# EAGLE design battery_monitor (EAGLE 6.6.0)
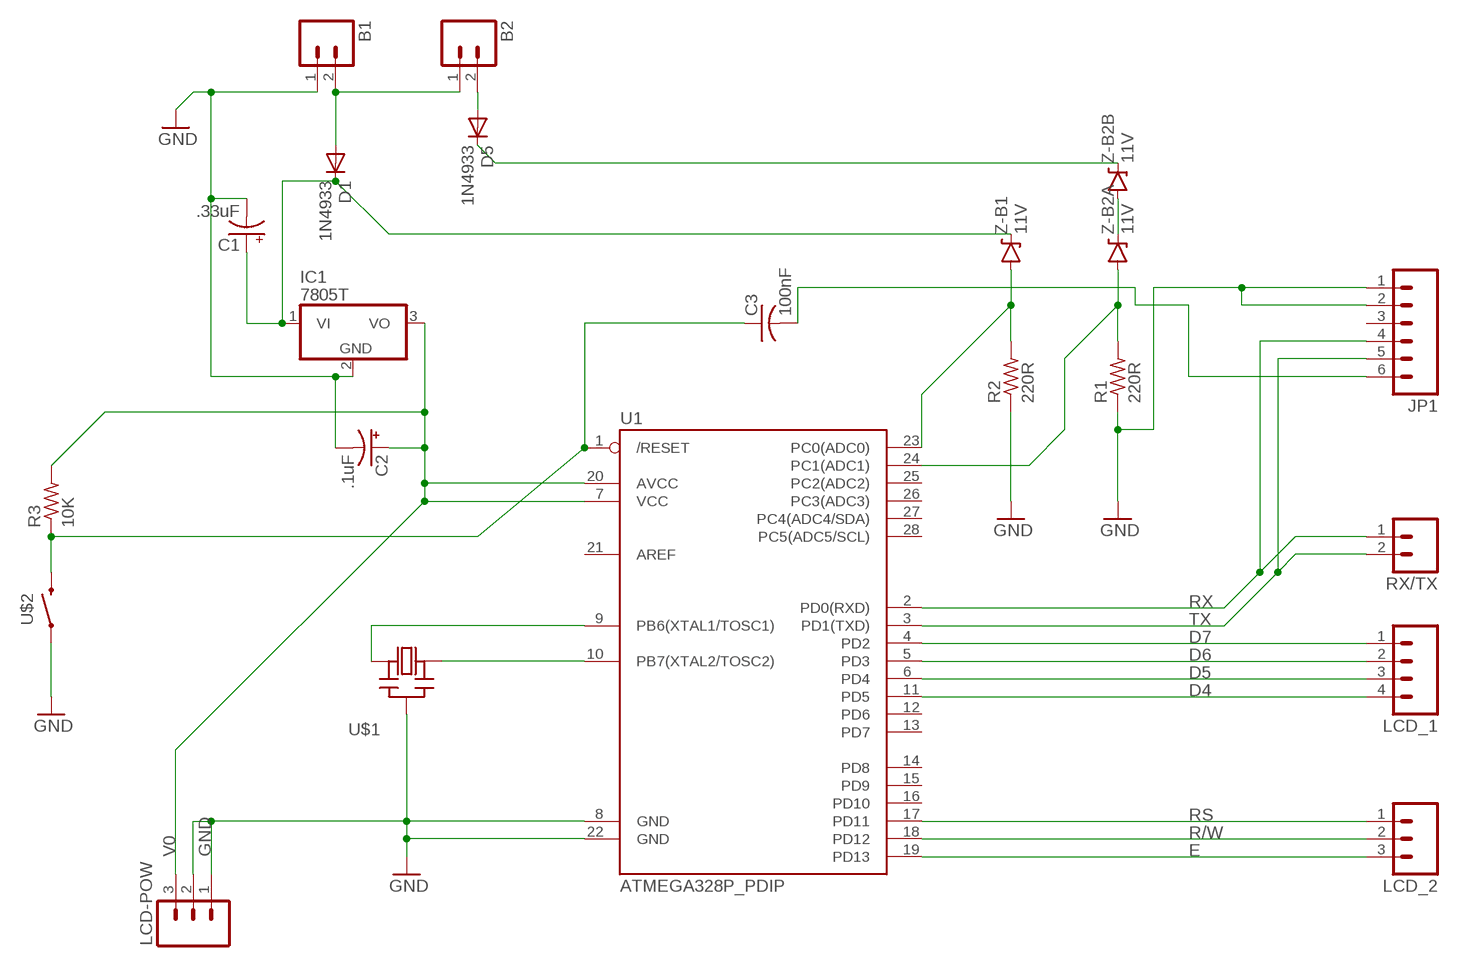
[diagram p0: schematic, sheet 1]

## Parts
B1  2-HOLES2-HOLES-5.08MM  [2-HOLES_BIG]
B2  2-HOLES2-HOLES-5.08MM  [2-HOLES_BIG]
C1  .33uF  CAPACITOR_POL  [E2,5-5]
C2  .1uF  CAPACITOR_POL  [E2,5-5]
C3  100nF  CAPACITOR050-025X075  [C050-025X075]
D1  1N4933  [DO41-10]
D5  1N4933  [DO41-10]
IC1  7805T  [TO220H]
JP1  M06LONGPADS  [1X06_LONGPADS]
LCD-POW  M03PTH  [1X03]
LCD_1  M04PTH  [1X04]
LCD_2  M03PTH  [1X03]
R1  220R  RESISTOR0207/10  [0207/10]
R2  220R  RESISTOR0207/10  [0207/10]
R3  10K  RESISTOR0207/10  [0207/10]
RX/TX  M02PTH  [1X02]
U1  ATMEGA328P_PDIP  [DIL28-3]
U$1  OSCILLATOR-THM  [CERM_OSC]
U$2  SWITCH-MOMENTARY4MM  [TACTILE_SWITCH_SMD]
Z-B1  11V  DIODE-ZENERPTH  [DIODE-ZENER]
Z-B2A  11V  DIODE-ZENERPTH  [DIODE-ZENER]
Z-B2B  11V  DIODE-ZENERPTH  [DIODE-ZENER]

## Nets
D4: LCD_1.4 U1.11(PD5)
D5: LCD_1.3 U1.6(PD4)
D6: LCD_1.2 U1.5(PD3)
D7: LCD_1.1 U1.4(PD2)
E: LCD_2.3 U1.19(PD13)
GND: B1.1 C1.- C2.- IC1.2(GND) JP1.1 JP1.2 LCD-POW.1 LCD-POW.2 R1.1 R2.1 U1.8(GND) U1.22(GND) U$1.P$2(GND) U$2.1 U$2.2
N$1: U1.10(PB7(XTAL2/TOSC2)) U$1.P$3(OUT)
N$2: U1.9(PB6(XTAL1/TOSC1)) U$1.P$1(IN)
N$3: B1.2 B2.1 D1.A
N$4: C1.+ D1.C IC1.1(VI) Z-B1.P$1(C)
N$5: Z-B2A.P$1(C) Z-B2B.P$2(A)
N$6: C3.1 R3.1 U1.1(/RESET) U$2.3 U$2.4
N$7: C3.2 JP1.6
N$8: R2.2 U1.23(PC0(ADC0)) Z-B1.P$2(A)
N$9: R1.2 U1.24(PC1(ADC1)) Z-B2A.P$2(A)
N$11: D5.C Z-B2B.P$1(C)
N$12: B2.2 D5.A
R/W: LCD_2.2 U1.18(PD12)
RS: LCD_2.1 U1.17(PD11)
RX: JP1.4 RX/TX.1 U1.2(PD0(RXD))
TX: JP1.5 RX/TX.2 U1.3(PD1(TXD))
V0: C2.+ IC1.3(VO) LCD-POW.3 R3.2 U1.7(VCC) U1.20(AVCC)
Unconnected: JP1.3 U1.12(PD6) U1.13(PD7) U1.14(PD8) U1.15(PD9) U1.16(PD10) U1.21(AREF) U1.25(PC2(ADC2)) U1.26(PC3(ADC3)) U1.27(PC4(ADC4/SDA)) U1.28(PC5(ADC5/SCL))

## Library data of the parts
B1 B2 = parts:2-HOLES: TERMINAL 2-PIN Holes for connecting 2 pin terminal
C1 C2 = parts:CAPACITOR_POL: POLARIZED CAPACITOR, American symbol
C3 = iStivi - RCLD:CAPACITOR: CAPACITOR, American symbol
D1 D5 = parts:1N4933: DIODE fast recovery rectifier, 1A
IC1 = parts:78*: Positive VOLTAGE REGULATOR Source: http://cache.national.com/ds/LM/LM78L05.pdf http://www.fairchildsemi.com/ds/LM/LM7805.pdf
JP1 = iStivi - Header-Connector:M06: Header 6 Standard 6-pin 0.1" header. Use with straight break away headers (SKU : PRT-00116), right angle break away headers (PRT-00553), swiss pins (PRT-00743), machine pins (PRT-00117), and female headers (PRT-00115). Molex polarized connector foot print use with SKU : PRT-08094 with associated crimp pins and housings. NOTES ON THE VARIANTS LOCK and LOCK_LONGPADS... This footprint was designed to help hold the alignment of a through-hole component (i.e. 6-pin header) while soldering it into place. You may notice that each hole has been shifted either up or down by 0.005 of an inch from it's more standard position (which is a perfectly straight line). This slight alteration caused the pins (the squares in the middle) to touch the edges of the holes. Because they are alternating, it causes a "brace" to hold the component in place. 0.005 has proven to be the perfect amount of "off-center" position when using our standard breakaway headers. Although looks a little odd when you look at the bare footprint, once you have a header in there, the alteration is very hard to notice. Also, if you push a header all the way into place, it is covered up entirely on the bottom side. This idea of altering the position of holes to aid alignment will be further integrated into the Sparkfun Library for other footprints. It can help hold any component with 3 or more connection pins.
LCD-POW LCD_2 = parts:M03: Header 3 Standard 3-pin 0.1" header. Use with straight break away headers (SKU : PRT-00116), right angle break away headers (PRT-00553), swiss pins (PRT-00743), machine pins (PRT-00117), and female headers (PRT-00115). Molex polarized connector foot print use with SKU : PRT-08232 with associated crimp pins and housings.
LCD_1 = parts:M04: Header 4 Standard 4-pin 0.1" header. Use with straight break away headers (SKU : PRT-00116), right angle break away headers (PRT-00553), swiss pins (PRT-00743), machine pins (PRT-00117), and female headers (PRT-00115). Molex polarized connector foot print use with SKU : PRT-08231 with associated crimp pins and housings. 1MM SMD Version SKU: PRT-10208
R1-R3 = parts:RESISTOR: RESISTOR
RX/TX = parts:M02: Header 2 Standard 2-pin 0.1" header. Use with straight break away headers (SKU : PRT-00116), right angle break away headers (PRT-00553), swiss pins (PRT-00743), machine pins (PRT-00117), and female headers (PRT-00115). Molex polarized connector foot print use with SKU : PRT-08233 with associated crimp pins and housings.
U1 = parts:ATMEGA328P_PDIP: uC used in the Arduino 32kb flash, 1k EEPROM, 2k SRAM This is the through-hole version of this chip.
U$1 = parts:OSCILLATOR: Ceramic oscillator with built in capacitors such as ZTT-12MHz http://www.ladyada.net/library/eagle
U$2 = parts:SWITCH-MOMENTARY: Momentary Switch
Z-B1 Z-B2A Z-B2B = parts:DIODE-ZENER: Zener Diode Production Part - 8199 3.4V Zener Voltage

## Board
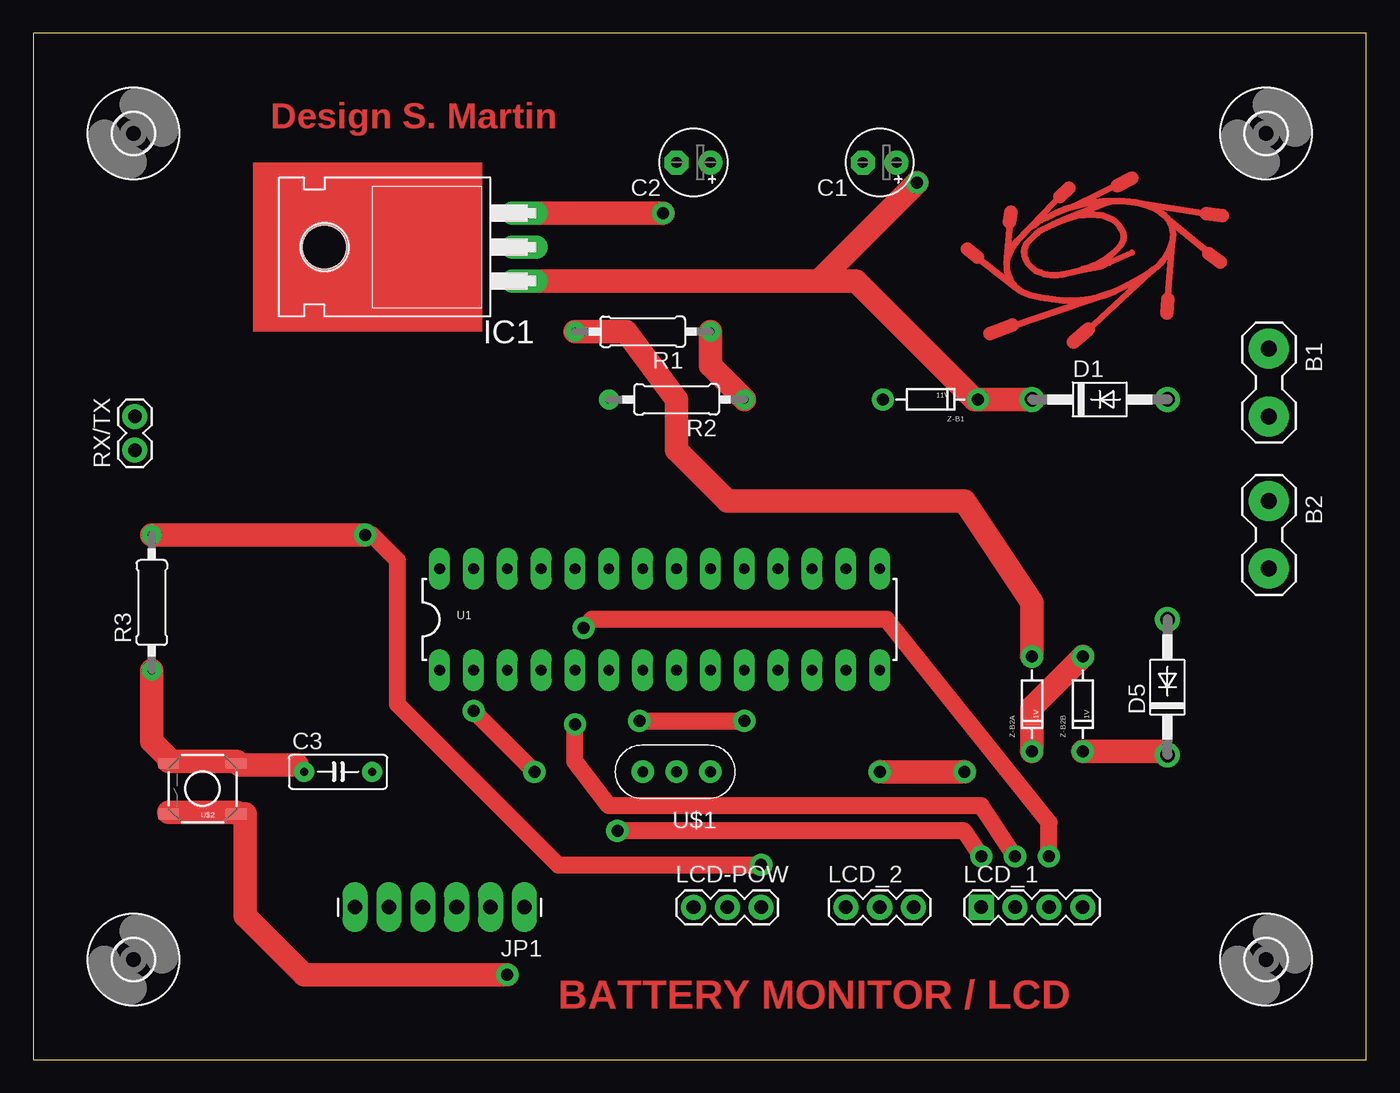
[diagram p1: board, top side]
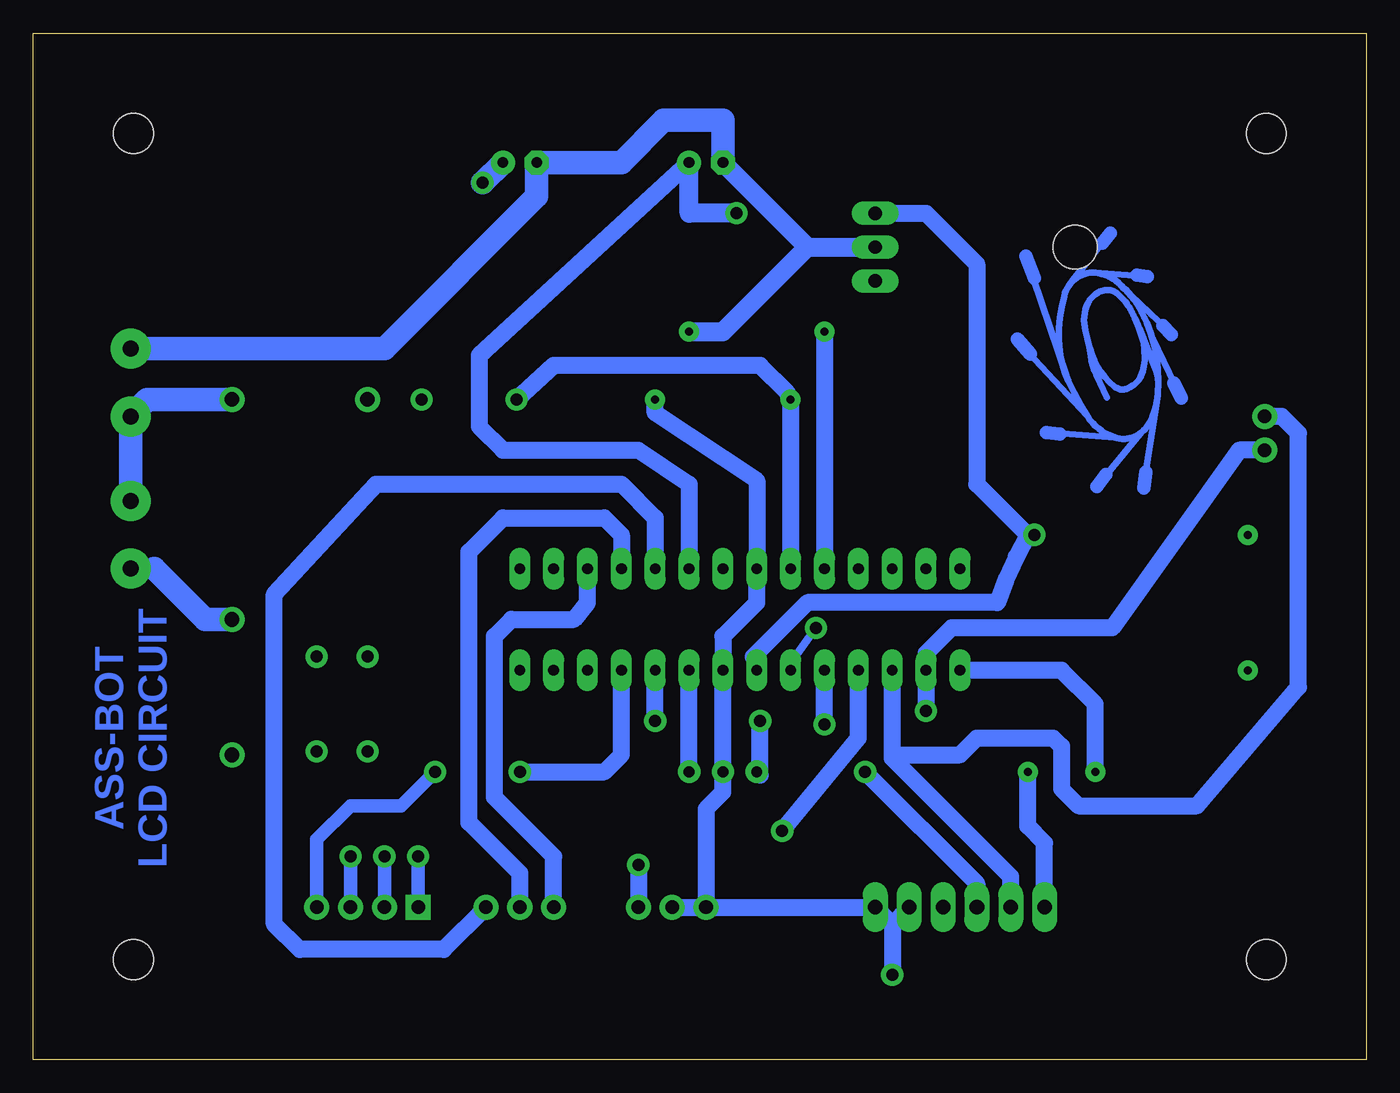
[diagram p2: board, bottom side, seen from below]

Size 100 x 77 mm. Coordinates in mm from the lower left corner, seen from the top.
Outline: 0,0 100,0 100,77 0,77 0,0
Copper layers (1*16): Top 0.035mm / dielectric 1.5mm / Bottom 0.035mm
Design rules "default *": minimum track width 24mil, minimum drill 0.9mm, track to track 20mil, track to pad 20mil, pad to pad 20mil, via to via 20mil, smd to smd 8mil, copper to edge 40mil, drill to drill 8mil, minimum pad ring 15mil, minimum via ring 15mil, stop-mask expansion 20mil, vias tented up to drill 0mil, thermal gap 10mil
tRestrict: area 90.2,45.7 to 95.2,55.9; area 90.2,34.3 to 95.2,44.5; area 69.8,10.2 to 80,12.7; area 59.7,10.2 to 67.3,12.7; area 48.3,10.2 to 55.9,12.7; area 6.3,44.5 to 8.9,49.5; area 29.2,35.6 to 64.8,38.1; area 29.2,27.9 to 64.8,30.5; area 44.5,19.1 to 52.1,21.6; area 22.9,8.9 to 38.1,14

### Footprints (pad centres in the part's own frame; a part is rotated, then mirrored left to right if it is on the bottom)
2-HOLES_BIG = drill 1.2 pad 3: 1 -2.54,0; 2 2.54,0
E2,5-5 = drill 0.8 pad 1.8: + -1.27,0 | drill 0.8 pad 1.8 octagon: - 1.27,0
C050-025X075 = drill 0.6 pad 1.5: 1 -2.54,0; 2 2.54,0
DO41-10 = drill 1.1: A 5.08,0; C -5.08,0
TO220H = drill 1 long: 1 -2.54,-10.16; 2 0,-10.16; 3 2.54,-10.16 | hole 3.302: 0,4.826
1X06_LONGPADS = drill 1.1 pad 1.88 long: 1 0,0; 2 2.54,0; 3 5.08,0; 4 7.62,0; 5 10.16,0; 6 12.7,0
1X03 = drill 1.016 pad 1.88: 1 0,0; 2 2.54,0; 3 5.08,0
1X04 = drill 1.016 pad 1.88 square: 1 0,0 | drill 1.016 pad 1.88: 2 2.54,0; 3 5.08,0; 4 7.62,0
0207/10 = drill 0.6 pad 1.5: 1 -5.08,0; 2 5.08,0
1X02 = drill 1 pad 1.88: 1 0,0; 2 2.54,0
DIL28-3 = drill 0.813 long: 1 -16.51,-3.81; 2 -13.97,-3.81; 3 -11.43,-3.81; 4 -8.89,-3.81; 5 -6.35,-3.81; 6 -3.81,-3.81; 7 -1.27,-3.81; 8 1.27,-3.81; 9 3.81,-3.81; 10 6.35,-3.81; 11 8.89,-3.81; 12 11.43,-3.81; 13 13.97,-3.81; 14 16.51,-3.81; 15 16.51,3.81; 16 13.97,3.81; 17 11.43,3.81; 18 8.89,3.81; 19 6.35,3.81; 20 3.81,3.81; 21 1.27,3.81; 22 -1.27,3.81; 23 -3.81,3.81; 24 -6.35,3.81; 25 -8.89,3.81; 26 -11.43,3.81; 27 -13.97,3.81; 28 -16.51,3.81
CERM_OSC = drill 0.813 pad 1.676: P$1 -2.54,0; P$2 0,0; P$3 2.54,0
TACTILE_SWITCH_SMD = smd 1.524 x 0.762: 1 -2.54,1.905; 2 2.54,1.905; 3 -2.54,-1.905; 4 2.54,-1.905
3,0 = hole 3: 0,0
DIODE-ZENER = drill 0.9: P$1 -3.556,0; P$2 3.556,0

### Placement (x,y rotation side)
B1  92.71,50.8 270 top
B2  92.71,39.37 270 top
C1  63.5,67.31 180 top
C2  49.53,67.31 180 top
C3  22.86,21.59 0 top
D1  80.01,49.53 0 top
D5  85.09,27.94 90 top
IC1  26.67,60.96 90 top
JP1  36.83,11.43 180 top
LCD-POW  49.53,11.43 0 top
LCD_1  71.12,11.43 0 top
LCD_2  60.96,11.43 0 top
R1  45.72,54.61 180 top
R2  48.26,49.53 180 top
R3  8.89,34.29 90 top
RX/TX  7.62,45.72 90 top
U1  46.99,33.02 0 top
U$1  48.26,21.59 180 top
U$2  12.7,20.32 180 top
U$3  [3,0]  7.5,7.5 0 top
U$4  [3,0]  92.5,7.5 0 top
U$5  [3,0]  7.5,69.5 0 top
U$6  [3,0]  92.5,69.5 0 top
U$7  [LOGO-SYNCHROTRON]  78.74,60.96 0 top
U$8  [LOGO-SYNCHROTRON]  19.05,53.34 270 bottom
Z-B1  67.31,49.53 180 top
Z-B2A  74.93,26.67 90 top
Z-B2B  78.74,26.67 90 top

### Tracks (layer width: path | path; a pad name or v marks a point on that pad's centre or on a via)
D4  (via drill 0.9)
  Top 1.778: v69.85,21.59 v63.5,21.59
  Bottom 1.016: LCD_1.4 78.74,16.51 76.2,19.05 72.39,19.05 v69.85,21.59
  Bottom 1.27: v63.5,21.59 57.15,21.59 55.88,22.86 U1.11
D5  (via drill 0.9)
  Top 1.27: v41.27,32.38 41.91,33.02 64.01,33.02 76.2,17.78 v76.2,15.24
  Bottom 0.61: U1.6 43.18,29.72 v41.27,32.38 | LCD_1.3 76.2,11.68
  Bottom 1.016: 76.2,11.68 v76.2,15.24
D6  (via drill 0.9)
  Top 1.27: v40.64,25.15 40.64,22.35 43.18,19.05 71.12,19.05 v73.66,15.24
  Bottom 0.61: LCD_1.2 73.66,11.94
  Bottom 1.016: 73.66,11.94 v73.66,15.24
  Bottom 1.27: v40.64,25.15 U1.5
D7  (via drill 0.9)
  Top 1.27: v43.81,17.14 69.85,17.14 v71.12,15.24
  Bottom 1.016: LCD_1.1 v71.12,15.24
  Bottom 1.27: U1.4 38.1,24.13 v43.81,17.14
E
  Bottom 1.27: U1.19 53.34,40.64 55.88,43.18 74.3,43.18 81.92,34.92 81.92,10.16 80.01,8.26 69.22,8.26 LCD_2.3
GND  (via drill 0.9)
  Top 0.61: 10.16,18.54 U$2.2 | 15.24,18.54 U$2.1 15.88,18.41
  Top 1.778: 15.24,18.54 10.16,18.54 | 15.88,18.41 15.88,10.79 20.32,6.35 v35.56,6.35 | R1.1 50.8,52.07 R2.1
  Bottom 0.61: 48.26,67.56 C2.- | 62.23,67.06 C1.-
  Bottom 1.27: 35.56,10.16 JP1.1 LCD-POW.1 | 35.56,10.16 v35.56,6.35 | 35.56,10.16 JP1.2 | LCD-POW.2 LCD-POW.1 | LCD-POW.1 49.53,18.8 48.26,20.07 U$1.P$2 U1.8 48.26,31.75 45.72,34.29 U1.22 45.72,43.43 53.34,48.51 R2.1
  Bottom 1.422: 41.91,60.96 IC1.2 | C2.- 41.91,60.96 | 41.91,60.96 48.26,54.61 R1.1
  Bottom 1.778: C1.- 55.88,67.31 52.7,70.48 48.26,70.48 48.26,67.56 | B1.1 73.66,53.34 62.23,64.77 62.23,67.06
N$1  (via drill 0.9)
  Top 1.27: v45.47,25.4 v53.34,25.4
  Bottom 1.27: v53.34,25.4 U1.10 | v45.47,25.4 45.47,21.34 U$1.P$3
N$2
  Bottom 1.27: U$1.P$1 U1.9
N$3
  Bottom 1.778: D1.A 91.44,49.53 B1.2 B2.1
N$4  (via drill 0.9)
  Top 0.61: 70.61,49.53 Z-B1.P$1 | 59.18,58.67 59.18,58.42
  Top 1.778: D1.C Z-B1.P$1 | IC1.1 59.18,58.42 61.72,58.42 70.61,49.53 | 59.18,58.67 v66.29,65.79
  Bottom 1.778: v66.29,65.79 C1.+
N$5
  Top 1.778: Z-B2A.P$1 74.93,26.42 Z-B2B.P$2
N$6
  Top 0.61: U$2.4 10.16,22.35 10.16,22.61 | 15.24,22.35 U$2.3 15.49,22.1 | C3.1 19.81,22.1
  Top 1.778: 15.24,22.35 10.16,22.35 | R3.1 8.89,23.88 10.16,22.61 | 19.81,22.1 15.49,22.1
  Bottom 1.27: U1.1 22.86,29.21 20.32,26.67 C3.1
N$7
  Bottom 1.27: C3.2 25.4,17.53 24.13,16.26 JP1.6
N$8
  Bottom 0.61: 43.43,50.04 43.18,39.88
  Bottom 1.27: R2.2 43.18,39.88 U1.23 | Z-B1.P$2 60.96,52.07 45.47,52.07 43.43,50.04
N$9
  Top 1.778: Z-B2A.P$2 74.93,34.29 69.85,41.91 52.07,41.91 48.26,45.72 48.26,49.53 44.45,54.61 R1.2
  Bottom 1.27: R1.2 U1.24
N$11
  Top 0.61: D5.C 84.84,23.11
  Top 1.778: 84.84,23.11 Z-B2B.P$1
N$12
  Bottom 0.61: B2.2 90.93,36.83
  Bottom 1.778: D5.A 87.12,33.02 90.93,36.83
R/W
  Bottom 1.27: U1.18 55.88,39.37 57.15,40.64 64.77,40.64 67.31,38.1 67.31,17.78 63.5,13.97 LCD_2.2
RS
  Bottom 1.27: U1.17 58.42,34.29 59.44,33.02 64.14,33.02 65.41,31.75 65.41,19.68 60.96,15.24 LCD_2.1
RX  (via drill 0.9)
  Top 1.27: v33.02,26.16 v37.59,21.59
  Bottom 1.27: RX/TX.1 9.53,45.72 19.05,32.38 31.11,32.38 33.02,30.48 U1.2 v33.02,26.16 | JP1.4 29.21,13.21 v37.59,21.59
TX
  Bottom 1.27: 35.56,22.86 35.56,22.61 26.67,13.72 JP1.5 | 35.56,22.86 U1.3 | RX/TX.2 6.35,48.26 5.08,46.99 5.08,27.94 12.7,19.05 21.59,19.05 22.86,20.32 22.86,23.5 23.5,24.13 29.21,24.13 30.48,22.86 35.56,22.86
V0  (via drill 0.9)
  Top 0.61: v24.89,39.37 25.4,39.37
  Top 1.27: v54.61,14.61 39.37,14.61 27.3,26.67 27.3,37.47 25.4,39.37
  Top 1.778: v24.89,39.37 R3.2 | IC1.3 v47.24,63.5
  Bottom 0.61: 45.97,30.23 U1.7 | v24.89,39.37 25.4,39.37
  Bottom 1.27: U1.20 50.8,43.18 54.61,45.72 64.77,45.72 66.55,47.5 66.55,52.83 C2.+ | 45.97,30.23 41.91,34.29 27.69,34.29 arc10 25.4,39.37 29.21,43.18 29.21,59.69 33.02,63.5 IC1.3 | v54.61,14.61 LCD-POW.3
  Bottom 1.422: v47.24,63.5 50.8,63.5 C2.+
(copper drawn outside any net)
  shapes: Top area x1

### Text on the board
Top: Design S. Martin | BATTERY MONITOR / LCD
Bottom: ASS-BOT / LCD CIRCUIT